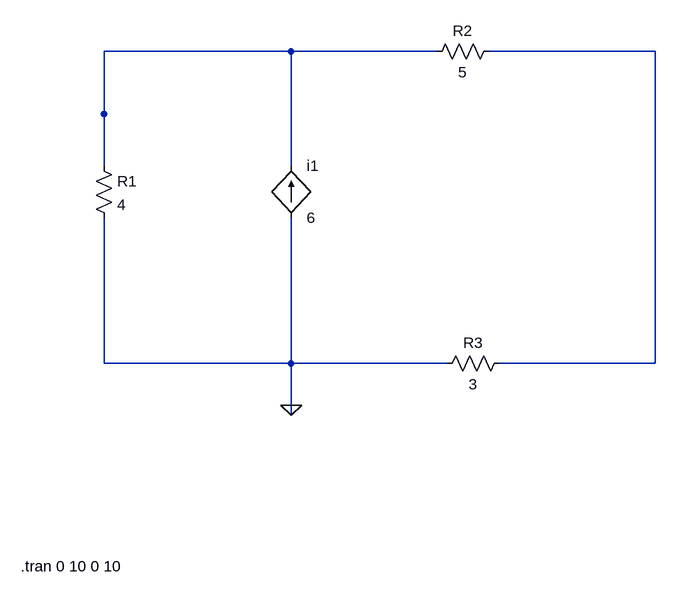
[diagram p0: schematic Draft4.asc]
Draft4.asc, the LTspice schematic file:
Version 4
SHEET 1 1044 712
WIRE 288 -96 0 -96
WIRE 512 -96 288 -96
WIRE 848 -96 592 -96
WIRE 0 80 0 -96
WIRE 288 80 288 -96
WIRE 0 384 0 160
WIRE 288 384 288 160
WIRE 288 384 0 384
WIRE 528 384 288 384
WIRE 848 384 848 -96
WIRE 848 384 608 384
WIRE 288 448 288 384
WIRE 288 464 288 448
WIRE 0 0 0 0
FLAG 288 448 0
SYMBOL bi2 288 80 R0
SYMATTR InstName i1
SYMATTR Value 6
SYMATTR Prefix i
SYMBOL res -16 64 R0
SYMATTR InstName R1
SYMATTR Value 4
SYMBOL res 496 -80 R270
WINDOW 0 32 56 VTop 2
WINDOW 3 0 56 VBottom 2
SYMATTR InstName R2
SYMATTR Value 5
SYMBOL res 512 400 R270
WINDOW 0 32 56 VTop 2
WINDOW 3 0 56 VBottom 2
SYMATTR InstName R3
SYMATTR Value 3
TEXT -128 696 Left 2 !.tran 0 10 0 10

The netlist it stands for:
* Draft4.asc
i1 0 N001 6
R1 N001 0 4
R2 N001 N002 5
R3 0 N002 3
.tran 0 10 0 10
.backanno
.end